# EAGLE design Charge controller (CAR) (EAGLE 7.6.0)
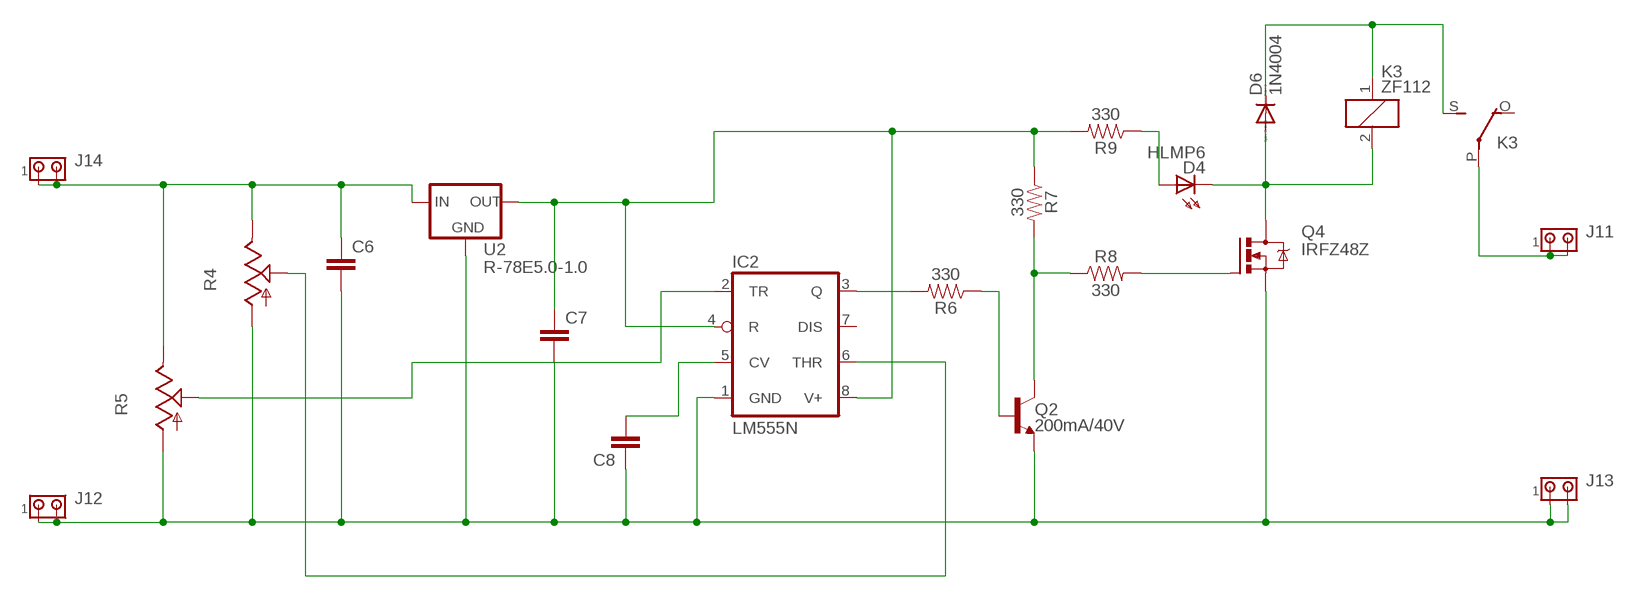
[diagram p0: schematic, sheet 1]

## Parts
C6  C5/2.5  [C5B2.5]
C7  C5/2.5  [C5B2.5]
C8  C5/2.5  [C5B2.5]
D4  HLMP6  [HLMP6]
D6  1N4004  [DO41-10]
IC2  LM555N  [DIL08]
J11  MTA02-156  [1X2MTA]
J12  MTA02-156  [1X2MTA]
J13  MTA02-156  [1X2MTA]
J14  MTA02-156  [1X2MTA]
K3  ZF112  [ZF112]
Q2  200mA/40V  TRANS_NPN-2N3904  [TO-92]
Q4  IRFZ48Z  [TO220BH]
R4  TRIM_US-CA6V  [CA6V]
R5  TRIM_US-CA6V  [CA6V]
R6  330  330OHM-HORIZ-1/10W-5%  [AXIAL-0.3]
R7  330  330OHM-HORIZ-1/10W-5%  [AXIAL-0.3]
R8  330  330OHM-HORIZ-1/10W-5%  [AXIAL-0.3]
R9  330  330OHM-HORIZ-1/10W-5%  [AXIAL-0.3]
U2  R-78E5.0-1.0  [DC-DC_CONVERTER_78XX]

## Nets
N$24: C6.1 J14.1 J14.2 R4.E R5.E U2.VIN(IN)
N$28: C6.2 C7.2 C8.1 IC2.1(GND) J12.1 J12.2 J13.1 J13.2 Q2.1(E) Q4.S R4.A R5.A U2.GND
N$29: C7.1 IC2.4(R) IC2.8(V+) R7.P$1 R9.P$2 U2.VOUT(OUT)
N$30: C8.2 IC2.5(CV)
N$31: IC2.2(TR) R5.S
N$32: D4.A R9.P$1
N$33: IC2.3(Q) R6.P$2
N$34: Q2.2(B) R6.P$1
N$35: Q2.3(C) R7.P$2 R8.P$1
N$36: Q4.G R8.P$2
N$37: D4.K D6.A K3.2 Q4.D
N$38: D6.C K3.1 K3.S(2:S)
N$39: IC2.6(THR) R4.S
N$42: J11.1 J11.2 K3.P(2:P)
Unconnected: IC2.7(DIS) K3.O(2:O)

## Library data of the parts
C6-C8 = capacitor-wima:C: CAPACITOR naming: grid - package width
D4 = display-hp:HLMP6: LED 2mm horizontal; MF: AGILENT TECHNOLOGIES; MPN: HLMP-6500; OC_FARNELL: 1652490; OC_NEWARK: 40K0088
D6 = diode:1N4004: DIODE general purpose rectifier, 1 A
IC2 = linear:*555: TIMER
J11-J14 = con-amp:MTA02-156: AMP connector
K3 = relay:ZF112: RELAY 1 x switch; OC_FARNELL: unknown; OC_NEWARK: unknown
Q2 = SparkFun-DiscreteSemi:TRANS_NPN: NPN transistor Current controlled devices typically used to amplify current or used as a switch. BC547 - COM-08928 <http://www.sparkfun.com/products/8928> (TO-92 45V 100mA) (1.Collector 2.Base 3.Emitter) 2N3904 - COM-00521 <http://www.sparkfun.com/products/521> (TO-92 40V 200mA) (1.Emitter 2.Base 3.Collector) P2N2222A - COM-12852 <http://www.sparkfun.com/products/12852> (TO-92 40V 600mA) (1.Collector 2.Base 3.Emitter); PROD_ID: TRANS-08447
Q4 = transistor-power:IRFZ48: N Channel HEXFET® Power MOSFET Logic Level Source: http://www.irf.com/product-info/datasheets/data/irfz48z.pdf
R4 R5 = pot:TRIM_US-: POTENTIOMETER
R6-R9 = SparkFun-Resistors:330OHM: 330Ω resistor A resistor is a passive two-terminal electrical component that implements electrical resistance as a circuit element. Resistors act to reduce current flow, and, at the same time, act to lower voltage levels within circuits. - Wikipedia; PROD_ID: RES-8371
U2 = SparkFun-IC-Power:R-78E5.0-1.0: Recom Power 5V 1A DC/DC Converter The Recom R-78E5.0-X.X is a compact DC/DC converter module that is a pin for pin drop-in replacement for the LM7805 linear voltage regulator. Specifications: Input Range: 7-28V Output Voltage: 5V Output Current: 1A Max Efficiency: 91% Datasheet <https://www.recom-power.com/pdf/Innoline/R-78Exx-1.0.pdf>; PROD_ID: COM-13655

## Board
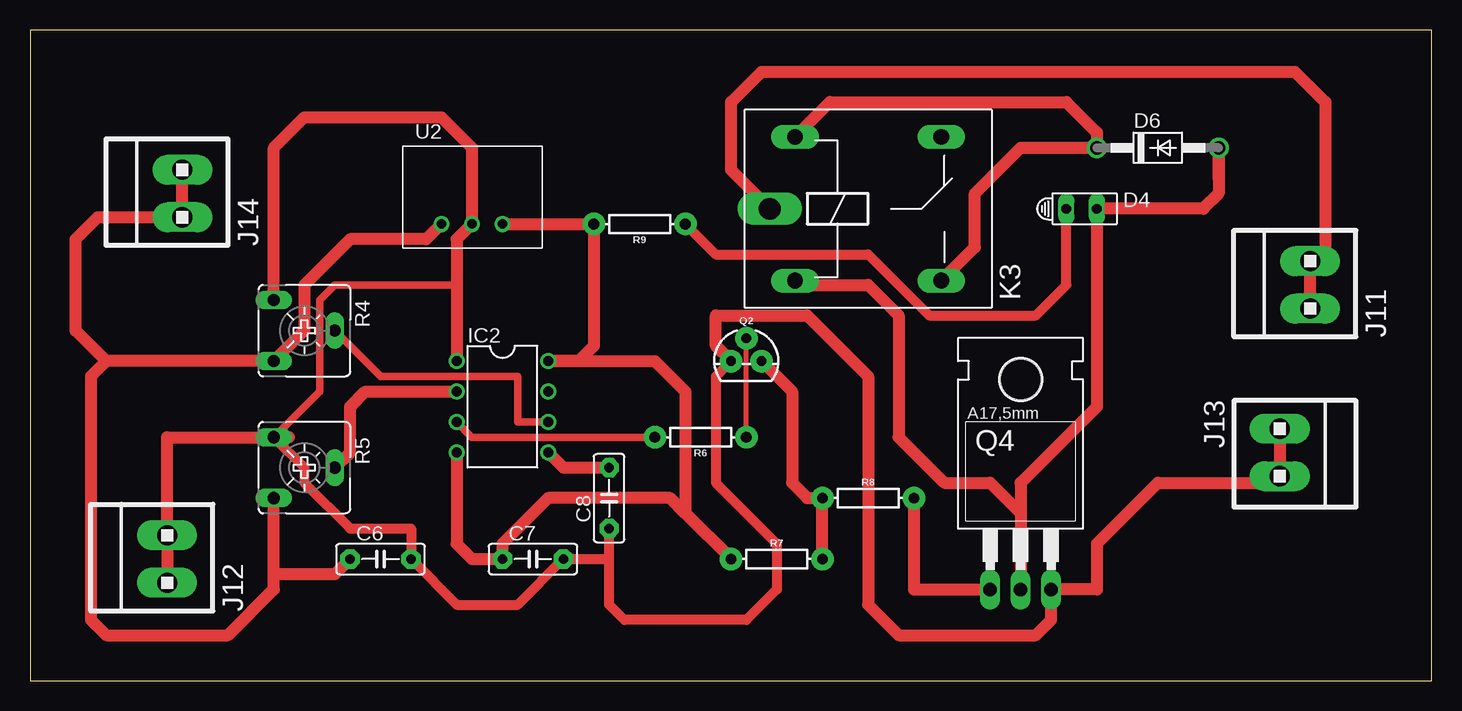
[diagram p1: board, top side]
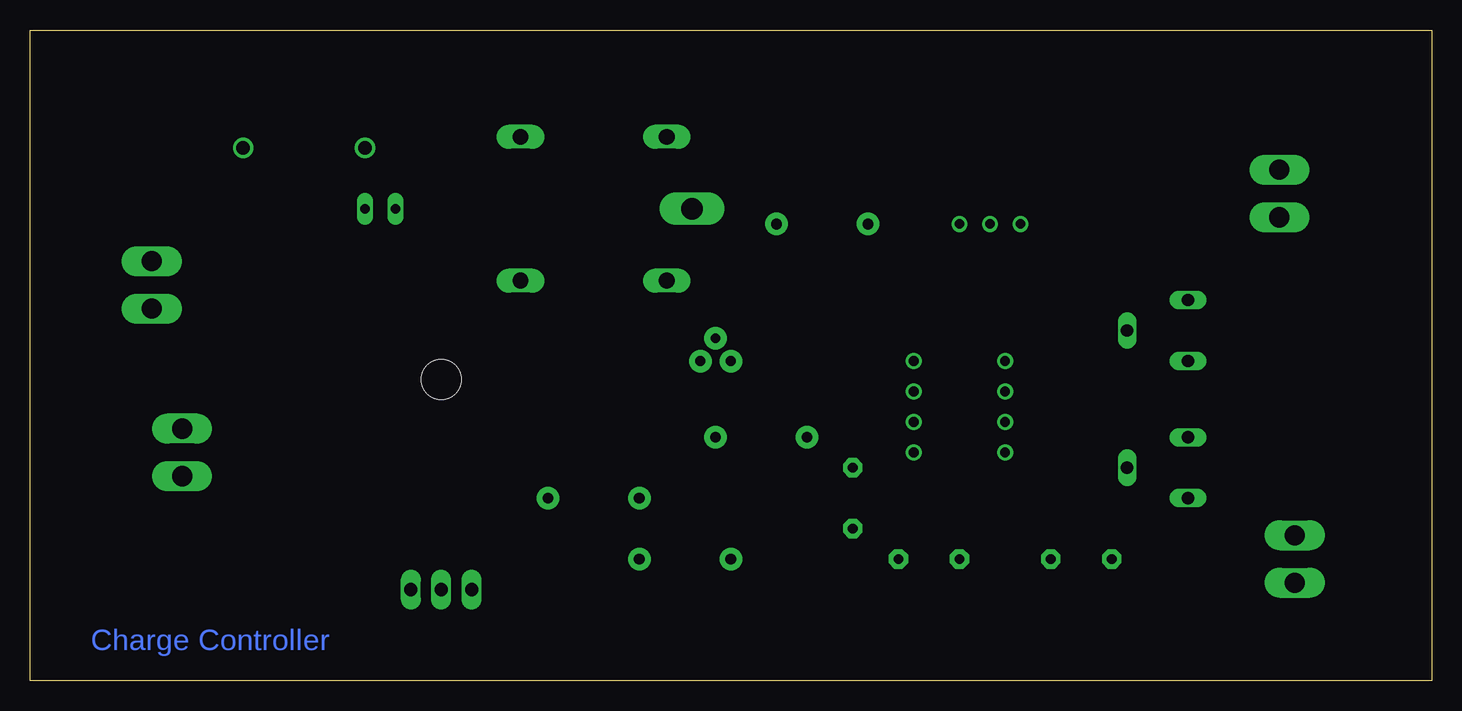
[diagram p2: board, bottom side, seen from below]

Size 116.82 x 54.28 mm. Coordinates in mm from the lower left corner, seen from the top.
Outline: 0,0 116.82,0 116.82,54.28 0,54.28 0,0
Copper layers (1*16): Top 0.035mm / dielectric 1.5mm / Bottom 0.035mm
Design rules "default": minimum track width 10mil, minimum drill 24mil, track to track 8mil, track to pad 8mil, pad to pad 8mil, via to via 8mil, smd to smd 8mil, copper to edge 40mil, drill to drill 8mil, minimum pad ring 10mil, minimum via ring 8mil, stop-mask expansion 4mil, vias tented up to drill 0mil, thermal gap 10mil

### Footprints (pad centres in the part's own frame; a part is rotated, then mirrored left to right if it is on the bottom)
C5B2.5 = drill 0.813 pad 1.6 octagon: 1 -2.54,0; 2 2.54,0
HLMP6 = drill 0.813 long: A -1.27,0; K 1.27,0
DO41-10 = drill 1.118: A 5.08,0; C -5.08,0
DIL08 = drill 0.813 pad 1.27: 1 -3.81,-3.81; 2 -1.27,-3.81; 3 1.27,-3.81; 4 3.81,-3.81; 5 3.81,3.81; 6 1.27,3.81; 7 -1.27,3.81; 8 -3.81,3.81
1X2MTA = drill 1.676 long: 1 1.981,0; 2 -1.981,0
ZF112 = drill 1.321 long: 1 -6.096,5.994; 2 -6.096,-5.994; O 6.096,5.994; S 6.096,-5.994 | drill 1.803 long: P -8.204,0
TO-92 = drill 0.813 pad 1.88: 1 -1.27,0; 2 0,1.905; 3 1.27,0
TO220BH = drill 1.118 long: D 0,-6.35; G -2.54,-6.35; S 2.54,-6.35 | hole 3.302: 0,11.176
CA6V = drill 1.016 long: A -2.54,-2.54; E 2.54,-2.54; S 0,2.54
AXIAL-0.3 = drill 0.9 pad 1.88: P$1 -3.81,0; P$2 3.81,0
DC-DC_CONVERTER_78XX = drill 0.8: GND 0,0; VIN -2.54,0; VOUT 2.54,0

### Placement (x,y rotation side)
C6  29.21,10.16 0 top
C7  41.91,10.16 0 top
C8  48.26,15.24 90 top
D4  87.63,39.37 0 top
D6  93.98,44.45 0 top
IC2  39.37,22.86 270 top
J11  106.68,33.02 90 top
J12  11.43,10.16 90 top
J13  104.14,19.05 270 top
J14  12.7,40.64 90 top
K3  69.85,39.37 0 top
Q2  59.69,26.67 0 top
Q4  82.55,13.97 0 top
R4  22.86,29.21 270 top
R5  22.86,17.78 270 top
R6  55.88,20.32 180 top
R7  62.23,10.16 0 top
R8  69.85,15.24 0 top
R9  50.8,38.1 180 top
U2  36.83,38.1 0 top

### Tracks (layer width: path | path; a pad name or v marks a point on that pad's centre or on a via)
N$24
  Top 1.016: 6.35,26.67 R4.E 22.86,29.21 22.86,33.02 26.67,36.83 33.02,36.83 U2.VIN | 6.35,26.67 5.08,25.4 5.08,5.08 6.35,3.81 16.51,3.81 20.32,7.62 20.32,8.89 | 20.32,8.89 R5.E | 6.35,26.67 3.81,29.21 3.81,36.83 5.64,38.66 J14.2 J14.1 12.7,43.18 | C6.1 25.4,8.89 20.32,8.89
N$28
  Top 0.406: 104.7,21.03 J13.2 | 104.14,16.51 J13.1
  Top 0.61: R5.A 24.13,24.13 24.13,31.75 25.4,33.02 35.56,33.02
  Top 0.813: R5.A 22.86,17.78 22.86,16.51 26.67,12.7 31.75,12.7 C6.2 35.56,6.35 40.64,6.35 C7.2 48.26,10.16 | 48.26,10.16 C8.1 | Q2.1 57.15,25.4 57.15,16.51 62.23,11.43 62.23,7.62 59.69,5.08 49.53,5.08 48.26,6.35 48.26,10.16
  Top 1.016: 21.59,20.32 R5.A 11.43,20.32 J12.1 J12.2 | R4.A 20.32,44.45 22.86,46.99 34.29,46.99 36.83,44.45 U2.GND 35.56,36.83 35.56,33.02 IC2.1 | Q2.1 57.15,27.94 57.15,30.48 64.77,30.48 69.85,25.4 69.85,6.35 72.39,3.81 83.82,3.81 85.09,5.08 Q4.S 88.9,7.62 88.9,11.43 93.98,16.51 104.14,16.51 | J13.2 J13.1
N$29
  Top 1.016: U2.VOUT R9.P$2 46.99,27.94 45.72,26.67 IC2.8 52.07,26.67 54.61,24.13 54.61,13.97 | IC2.4 35.56,11.43 36.83,10.16 C7.1 39.37,11.43 43.18,15.24 53.34,15.24 54.61,13.97 | R7.P$1 54.61,13.97
N$30
  Top 1.016: IC2.5 44.45,17.78 C8.2
N$31
  Top 1.016: R5.S 26.67,19.05 26.67,22.86 27.94,24.13 IC2.2
N$32
  Top 0.813: R9.P$1 57.15,35.56 69.85,35.56 74.93,30.48 83.82,30.48 86.36,33.02 D4.A
N$33
  Top 0.61: IC2.3 36.83,20.32 R6.P$2
N$34
  Top 0.406: R6.P$1 Q2.2
N$35
  Top 1.016: Q2.3 63.5,24.13 63.5,16.51 64.77,15.24 R8.P$1 R7.P$2
N$36
  Top 1.016: R8.P$2 73.66,7.62 Q4.G
N$37
  Top 1.016: K3.2 64.11,33.02 69.85,33.02 72.39,30.48 72.39,20.32 76.2,16.51 80.01,16.51 82.55,13.97 | 82.55,13.97 Q4.D | 82.55,13.97 82.55,16.51 88.9,22.86 D4.K 97.79,39.37 99.06,40.64 D6.A 99.06,41.91
N$38
  Top 1.016: K3.1 66.65,48.26 86.36,48.26 88.9,45.72 D6.C 82.55,44.45 78.74,40.64 78.74,36.17 K3.S
N$39
  Top 0.61: R4.S 29.21,25.4 40.64,25.4 40.64,21.59 IC2.6
N$42
  Top 0.406: 105.41,34.29 106.12,35 J11.1
  Top 1.016: K3.P 58.42,42.6 58.42,48.26 60.96,50.8 105.41,50.8 107.95,48.26 107.95,35.56 107.39,35 J11.1 J11.2

### Text on the board
Bottom: Charge Controller